# Altium project 传感器模块.PrjPcb
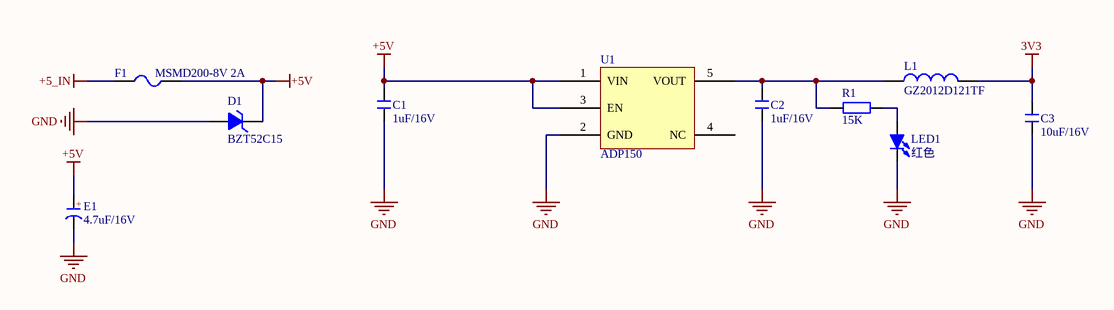
[diagram p0: POW.SchDoc]
6 sheets, 87 parts. Net scope: global (net labels, ports and power ports of the same name join across sheets).
Board file: PCB1.PcbDoc
Sheets:
  POW.SchDoc
  BMX160.SchDoc
  BME280.SchDoc
  TMP102.SchDoc
  OPT3001.SchDoc
  OUT_PIN.SchDoc

## Sheet POW.SchDoc
size A4; SheetNumber: 1; SheetTotal: 6

### Parts
C1  1uF/16V  [C 0402_L]
C2  1uF/16V  [C 0402_L]
C3  10uF/16V  [C 0603_L]
D1  BZT52C15  [SOD-123]
E1  4.7uF/16V  [CD A(3216)]
F1  MSMD200-8V 2A  [FU 0603]
L1  GZ2012D121TF  [L 0805]
LED1  红色  [LED]
R1  15K  [R 0402_L]
U1  ADP150  [SOT23-5]

### Nets
3V3: C3.2 L1.2
+5_IN: F1.1
+5V: C1.2 D1.2(K) E1.1(A) F1.2 U1.1(VIN) U1.3(EN)
GND: C1.1 C2.1 C3.1 D1.1(A) E1.2(K) LED1.2(K) U1.2(GND)
NetC2_2: C2.2 L1.1 R1.1 U1.5(VOUT)
NetLED1_1: LED1.1(A) R1.2

Not connected (* = marked no-connect by the designer): U1 4(NC)

### Notes on the sheet
- (in symbol C-CD) +

### Library data of the parts
C1 C2 = C: 贴片电容; 主类型: 电容; 值精度: ±10%; 元件封装: 0402; 具体类型: 陶瓷电容; 封装类型: 贴片; 温度漂移: X5R; 生产商: SAMSUNG(三星); 生产商零件编码: CL05A105KO5NNNC; 值/型号: 1uF/16V; 立创编号: C29266
C3 = C: 贴片电容; 主类型: 电容; 值精度: ±10%; 元件封装: 0603; 具体类型: 陶瓷电容; 封装类型: 贴片; 温度漂移: X5R; 生产商: SAMSUNG(三星); 生产商零件编码: CL10A106MO8NQNC; 值/型号: 10uF/16V; 立创编号: C92487
D1 = IN4735A: 主类型: 二极管; 具体类型: 稳压二极管; 封装类型: 贴片; 生产商: MDD; 值/型号: BZT52C15; 元件封装: SOD-123; 生产商零件编码: BZT52C15; 立创编号: C173427
E1 = C-CD: 聚合物电容 4.7uF/16V; 主类型: 电容; 值精度: ±20%; 元件封装: CASE-A_3216; 封装类型: 贴片; 温度范围: -55℃ ~ +105℃; 生产商: Sunlord(顺络); 生产商零件编码: TC211A475M016A; 值/型号: 4.7uF/16V; 具体类型: 聚合物电容; 立创编号: C136628
F1 = FU: 贴片保险丝; 版权归属: 源创客; BOM名称: 贴片保险丝; 学习资源: www.ooocke.com
L1 = L: 小功率贴片电感; 主类型: 电感; 生产商: Sunlord(顺络); 值/型号: GZ2012D121TF; 生产商零件编码: GZ2012D121TF; 立创编号: C38480
LED1 = LED-SMD: C84267
R1 = R: 贴片电阻 0402 5%; 主类型: 电阻; 值精度: ±1%; 元件封装: 0402; 封装类型: 贴片; 温度漂移: 50ppm; 生产商: 国巨; 生产商零件编码: RT0402FRE0715KL; 值/型号: 15K; 具体类型: 贴片电阻; 立创编号: C136975
U1 = ADP150: ADP150AUJZ-3.3-R7; 主类型: 电源芯片; 元件封装: SOT-23-5; 具体类型: 线性稳压芯片; 封装类型: 贴片; 生产商: ADI(亚德诺)/LINEAR; 值/型号: ADP150AUJZ-3.3-R7; 生产商零件编码: ADP150AUJZ-3.3-R7; 立创编号: C29149

## Sheet BMX160.SchDoc
size A4; SheetNumber: 2; SheetTotal: 6
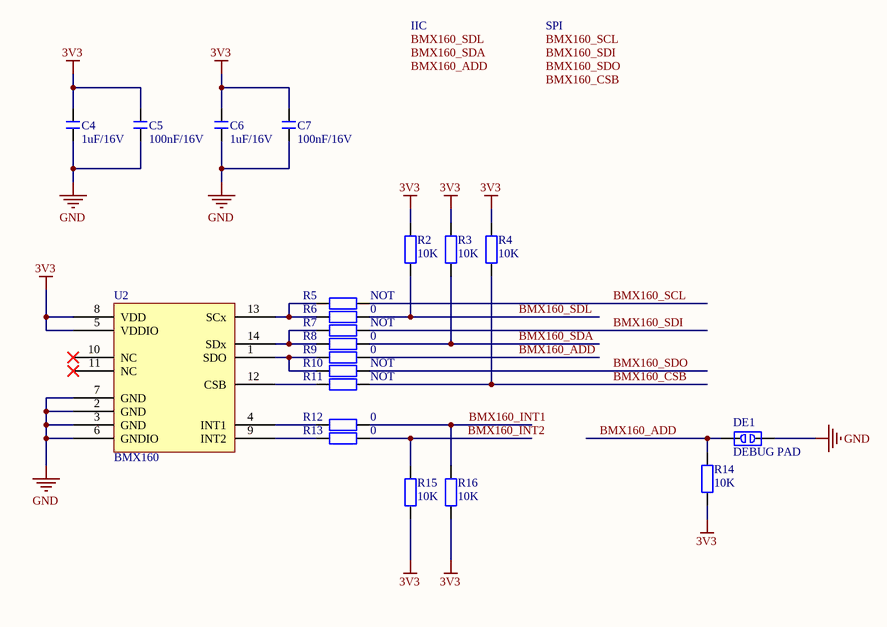
[diagram p1: BMX160.SchDoc]

### Parts
C4  1uF/16V  [C 0402_L]
C5  100nF/16V  [C 0402_L]
C6  1uF/16V  [C 0402_L]
C7  100nF/16V  [C 0402_L]
DE1  DEBUG PAD  [DEBUG_A]
R2  10K  [R 0402_L]
R3  10K  [R 0402_L]
R4  10K  [R 0402_L]
R5  NOT  [R 0402_L]
R6  0  [R 0402_L]
R7  NOT  [R 0402_L]
R8  0  [R 0402_L]
R9  0  [R 0402_L]
R10  NOT  [R 0402_L]
R11  NOT  [R 0402_L]
R12  0  [R 0402_L]
R13  0  [R 0402_L]
R14  10K  [R 0402_L]
R15  10K  [R 0402_L]
R16  10K  [R 0402_L]
U2  BMX160  [BMX160]

### Nets
3V3: C4.2 C5.1 C6.2 C7.1 R2.1 R3.1 R4.1 R14.1 R15.1 R16.1 U2.5(VDDIO) U2.8(VDD)
GND: C4.1 C5.2 C6.1 C7.2 DE1.2 U2.2(GND) U2.3(GND) U2.6(GNDIO) U2.7(GND)
BMX160_ADD: DE1.1 R9.1 R14.2
BMX160_CSB: R4.2 R11.1
BMX160_INT1: R12.1 R16.2
BMX160_INT2: R13.1 R15.2
BMX160_SCL: R5.1
BMX160_SDA: R3.2 R8.1
BMX160_SDI: R7.1
BMX160_SDL: R2.2 R6.1
BMX160_SDO: R10.1
NetR5_2: R5.2 R6.2 U2.13(SCx)
NetR7_2: R7.2 R8.2 U2.14(SDx)
NetR9_2: R9.2 R10.2 U2.1(SDO)
NetR11_2: R11.2 U2.12(CSB)
NetR12_2: R12.2 U2.4(INT1)
NetR13_2: R13.2 U2.9(INT2)

Not connected (* = marked no-connect by the designer): U2 10(NC)* 11(NC)*

### Notes on the sheet
- IIC
- SPI
- Labels drawn without touching a wire or pin: BMX160_ADD, BMX160_CSB, BMX160_SCL, BMX160_SDA, BMX160_SDI, BMX160_SDL, BMX160_SDO

### Library data of the parts
C4 C6 = C: as C1 on sheet POW; 值/型号: 1uF/16V; 立创编号: C29266
C5 C7 = C: 无极性贴片电容; 主类型: 电容; 封装类型: 贴片; 生产商: YAGEO(国巨); 生产商零件编码: CC0402KRX7R7BB104; 值/型号: 100nF/16V; 元件封装: *; 具体类型: *; 温度漂移: *; 温度范围: *; 立创编号: C60474; 类型备注: *; 手册网址: *; 官网地址: *
DE1 = DEBUG: 调试断点焊盘; 版权归属: 源创客; BOM名称: 调试断点焊盘; 学习资源: www.ooocke.com
R2-R4 R14-R16 = R: 贴片电阻 0402 1%; 主类型: 电阻; 元件封装: 0402; 封装类型: 贴片; 温度漂移: ±100ppm/℃; 生产商: 国巨; 生产商零件编码: RC0402FR-0710KL; 值/型号: 10K; 值精度: ±1%; 具体类型: 贴片电阻; 立创编号: C60490
R5 R7 R10 R11 = R: 贴片电阻; 主类型: 电阻; 值/型号: 0; 元件封装: 0402; 封装类型: 贴片; 生产商: YAGEO（国巨）; 生产商零件编码: RC0402FR-0710KL; 立创编号: C60490
R6 R8 R9 R12 R13 = R: 贴片电阻; 主类型: 电阻; 元件封装: 0402; 封装类型: 贴片; 生产商: YAGEO（国巨）; 生产商零件编码: RC0402FR-0710KL; 值/型号: 0; 立创编号: C60490

## Sheet BME280.SchDoc
size A4; SheetNumber: 3; SheetTotal: 6
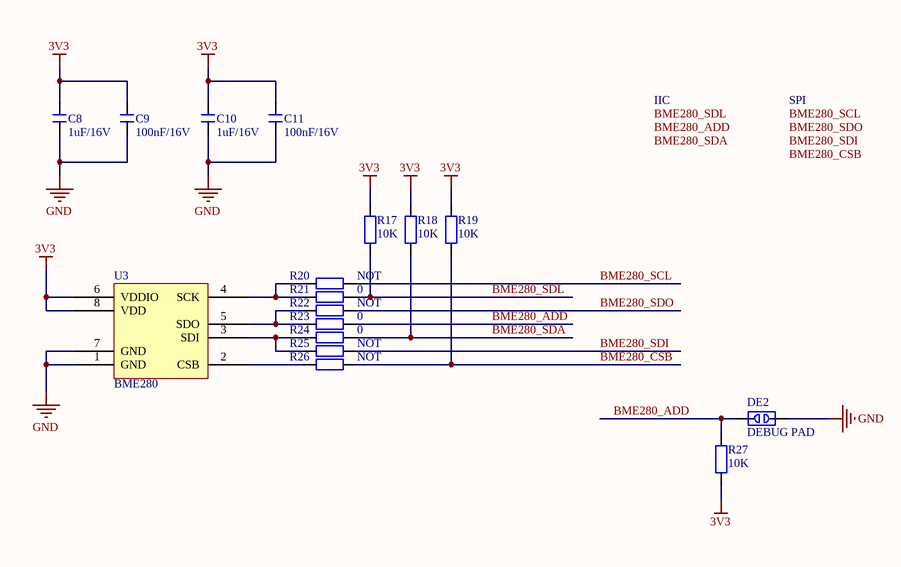
[diagram p2: BME280.SchDoc]

### Parts
C8  1uF/16V  [C 0402_L]
C9  100nF/16V  [C 0402_L]
C10  1uF/16V  [C 0402_L]
C11  100nF/16V  [C 0402_L]
DE2  DEBUG PAD  [DEBUG_A]
R17  10K  [R 0402_L]
R18  10K  [R 0402_L]
R19  10K  [R 0402_L]
R20  NOT  [R 0402_L]
R21  0  [R 0402_L]
R22  NOT  [R 0402_L]
R23  0  [R 0402_L]
R24  0  [R 0402_L]
R25  NOT  [R 0402_L]
R26  NOT  [R 0402_L]
R27  10K  [R 0402_L]
U3  BME280  [BME280]

### Nets
3V3: C8.2 C9.1 C10.2 C11.1 R17.1 R18.1 R19.1 R27.1 U3.6(VDDIO) U3.8(VDD)
GND: C8.1 C9.2 C10.1 C11.2 DE2.2 U3.1(GND) U3.7(GND)
BME280_ADD: DE2.1 R23.1 R27.2
BME280_CSB: R19.2 R26.1
BME280_SCL: R20.1
BME280_SDA: R18.2 R24.1
BME280_SDI: R25.1
BME280_SDL: R17.2 R21.1
BME280_SDO: R22.1
NetR20_2: R20.2 R21.2 U3.4(SCK)
NetR22_2: R22.2 R23.2 U3.5(SDO)
NetR24_2: R24.2 R25.2 U3.3(SDI)
NetR26_2: R26.2 U3.2(CSB)

### Notes on the sheet
- IIC
- SPI
- Labels drawn without touching a wire or pin: BME280_ADD, BME280_CSB, BME280_SCL, BME280_SDA, BME280_SDI, BME280_SDL, BME280_SDO

### Library data of the parts
C8 C10 = C: as C1 on sheet POW; 值/型号: 1uF/16V; 立创编号: C29266
C9 C11 = C: as C5 on sheet BMX160; 值/型号: 100nF/16V; 元件封装: *; 具体类型: *; 温度漂移: *; 温度范围: *; 立创编号: C60474; 类型备注: *; 手册网址: *; 官网地址: *
DE2 = DEBUG: 调试断点焊盘; 版权归属: 源创客; BOM名称: 调试断点焊盘; 学习资源: www.ooocke.com
R17-R19 R27 = R: as R2 on sheet BMX160; 值/型号: 10K; 值精度: ±1%; 具体类型: 贴片电阻; 立创编号: C60490
R20 R22 R25 R26 = R: 贴片电阻; 主类型: 电阻; 值/型号: 0; 元件封装: 0402; 生产商: YAGEO(国巨); 生产商零件编码: RC0402JR-070RL; 立创编号: C60485
R21 R23 R24 = R: 贴片电阻; 主类型: 电阻; 元件封装: 0402; 生产商: YAGEO(国巨); 生产商零件编码: RC0402JR-070RL; 值/型号: 0; 立创编号: C60485

## Sheet TMP102.SchDoc
size A4; SheetNumber: 4; SheetTotal: 6
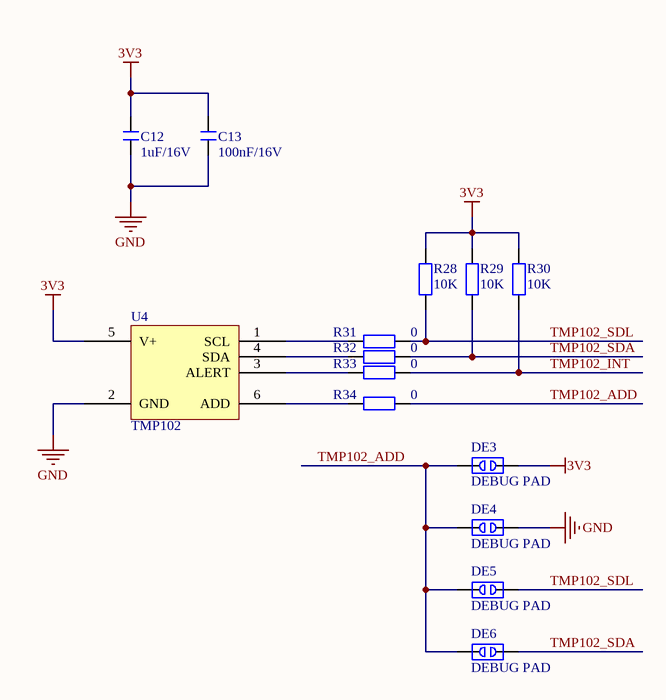
[diagram p3: TMP102.SchDoc]

### Parts
C12  1uF/16V  [C 0402_L]
C13  100nF/16V  [C 0402_L]
DE3  DEBUG PAD  [DEBUG_A]
DE4  DEBUG PAD  [DEBUG_A]
DE5  DEBUG PAD  [DEBUG_A]
DE6  DEBUG PAD  [DEBUG_A]
R28  10K  [R 0402_L]
R29  10K  [R 0402_L]
R30  10K  [R 0402_L]
R31  0  [R 0402_L]
R32  0  [R 0402_L]
R33  0  [R 0402_L]
R34  0  [R 0402_L]
U4  TMP102  [TMP102]

### Nets
3V3: C12.2 C13.1 DE3.2 R28.1 R29.1 R30.1 U4.5(V+)
GND: C12.1 C13.2 DE4.2 U4.2(GND)
TMP102_ADD: DE3.1 DE4.1 DE5.1 DE6.1 R34.1
TMP102_INT: R30.2 R33.1
TMP102_SDA: DE6.2 R29.2 R32.1
TMP102_SDL: DE5.2 R28.2 R31.1
NetR31_2: R31.2 U4.1(SCL)
NetR32_2: R32.2 U4.4(SDA)
NetR33_2: R33.2 U4.3(ALERT)
NetR34_2: R34.2 U4.6(ADD)

### Library data of the parts
C12 = C: as C1 on sheet POW; 值/型号: 1uF/16V; 立创编号: C29266
C13 = C: as C5 on sheet BMX160; 值/型号: 100nF/16V; 元件封装: *; 具体类型: *; 温度漂移: *; 温度范围: *; 立创编号: C60474; 类型备注: *; 手册网址: *; 官网地址: *
DE3-DE6 = DEBUG: 调试断点焊盘; 版权归属: 源创客; BOM名称: 调试断点焊盘; 学习资源: www.ooocke.com
R28-R30 = R: as R2 on sheet BMX160; 值/型号: 10K; 值精度: ±1%; 具体类型: 贴片电阻; 立创编号: C60490
R31-R34 = R: as R21 on sheet BME280; 值/型号: 0; 立创编号: C60485

## Sheet OPT3001.SchDoc
size A4; SheetNumber: 5; SheetTotal: 6
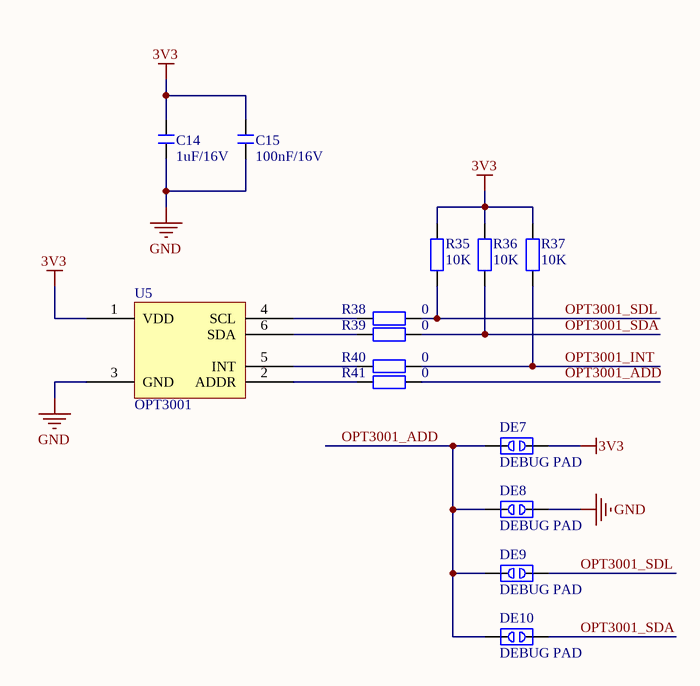
[diagram p4: OPT3001.SchDoc]

### Parts
C14  1uF/16V  [C 0402_L]
C15  100nF/16V  [C 0402_L]
DE7  DEBUG PAD  [DEBUG_A]
DE8  DEBUG PAD  [DEBUG_A]
DE9  DEBUG PAD  [DEBUG_A]
DE10  DEBUG PAD  [DEBUG_A]
R35  10K  [R 0402_L]
R36  10K  [R 0402_L]
R37  10K  [R 0402_L]
R38  0  [R 0402_L]
R39  0  [R 0402_L]
R40  0  [R 0402_L]
R41  0  [R 0402_L]
U5  OPT3001  [OPT3001]

### Nets
3V3: C14.2 C15.1 DE7.2 R35.1 R36.1 R37.1 U5.1(VDD)
GND: C14.1 C15.2 DE8.2 U5.3(GND)
OPT3001_ADD: DE7.1 DE8.1 DE9.1 DE10.1 R41.1
OPT3001_INT: R37.2 R40.1
OPT3001_SDA: DE10.2 R36.2 R39.1
OPT3001_SDL: DE9.2 R35.2 R38.1
NetR38_2: R38.2 U5.4(SCL)
NetR39_2: R39.2 U5.6(SDA)
NetR40_2: R40.2 U5.5(INT)
NetR41_2: R41.2 U5.2(ADDR)

### Library data of the parts
C14 = C: as C1 on sheet POW; 值/型号: 1uF/16V; 立创编号: C29266
C15 = C: as C5 on sheet BMX160; 值/型号: 100nF/16V; 元件封装: *; 具体类型: *; 温度漂移: *; 温度范围: *; 立创编号: C60474; 类型备注: *; 手册网址: *; 官网地址: *
DE7-DE10 = DEBUG: 调试断点焊盘; 版权归属: 源创客; BOM名称: 调试断点焊盘; 学习资源: www.ooocke.com
R35-R37 = R: as R2 on sheet BMX160; 值/型号: 10K; 值精度: ±1%; 具体类型: 贴片电阻; 立创编号: C60490
R38-R41 = R: as R21 on sheet BME280; 值/型号: 0; 立创编号: C60485

## Sheet OUT_PIN.SchDoc
size A4; SheetNumber: 6; SheetTotal: 6
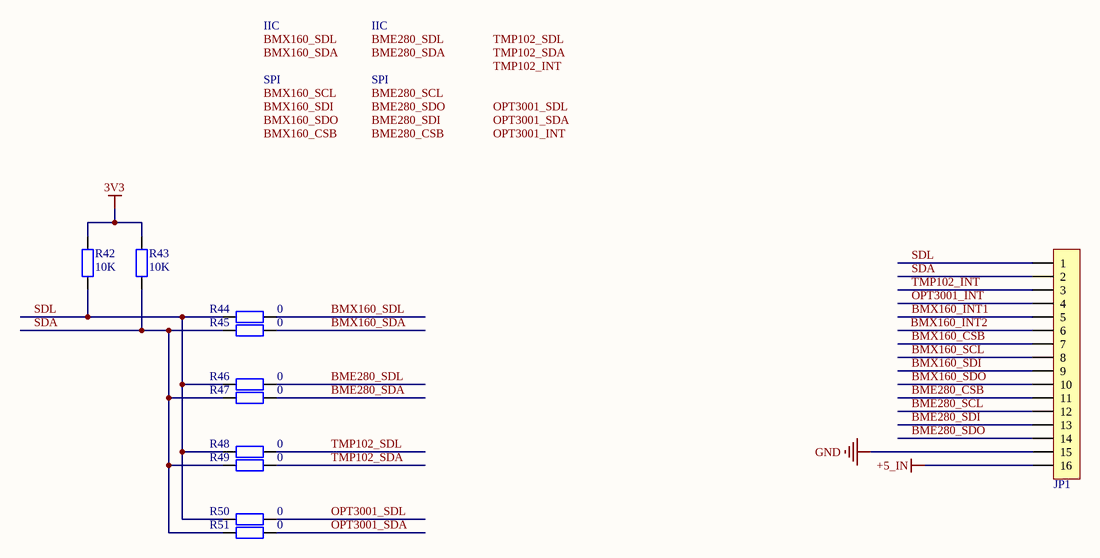
[diagram p5: OUT_PIN.SchDoc]

### Parts
JP1  HDR-1X16  [HDR2.54-LI-16P]  (value not drawn)
R42  10K  [R 0402_L]
R43  10K  [R 0402_L]
R44  0  [R 0402_L]
R45  0  [R 0402_L]
R46  0  [R 0402_L]
R47  0  [R 0402_L]
R48  0  [R 0402_L]
R49  0  [R 0402_L]
R50  0  [R 0402_L]
R51  0  [R 0402_L]

### Nets
3V3: R42.1 R43.1
+5_IN: JP1.16
GND: JP1.15
BME280_CSB: JP1.11
BME280_SCL: JP1.12
BME280_SDA: R47.1
BME280_SDI: JP1.13
BME280_SDL: R46.1
BME280_SDO: JP1.14
BMX160_CSB: JP1.7
BMX160_INT1: JP1.5
BMX160_INT2: JP1.6
BMX160_SCL: JP1.8
BMX160_SDA: R45.1
BMX160_SDI: JP1.9
BMX160_SDL: R44.1
BMX160_SDO: JP1.10
OPT3001_INT: JP1.4
OPT3001_SDA: R51.1
OPT3001_SDL: R50.1
SDA: JP1.2 R43.2 R45.2 R47.2 R49.2 R51.2
SDL: JP1.1 R42.2 R44.2 R46.2 R48.2 R50.2
TMP102_INT: JP1.3
TMP102_SDA: R49.1
TMP102_SDL: R48.1

### Notes on the sheet
- IIC
- SPI
- Labels drawn without touching a wire or pin: BME280_CSB, BME280_SCL, BME280_SDA, BME280_SDI, BME280_SDL, BME280_SDO, BMX160_CSB, BMX160_SCL, BMX160_SDA, BMX160_SDI, BMX160_SDL, BMX160_SDO, OPT3001_INT, OPT3001_SDA, OPT3001_SDL, TMP102_INT, TMP102_SDA, TMP102_SDL

### Library data of the parts
JP1 = Header 16: 16P接插件; 版权归属: 源创客; BOM名称: 16P接插件; 学习资源: www.ooocke.com
R42 R43 = R: as R2 on sheet BMX160; 值/型号: 10K; 值精度: ±1%; 具体类型: 贴片电阻; 立创编号: C60490
R44-R51 = R: 贴片电阻; 主类型: 电阻; 生产商: YAGEO（国巨）; 生产商零件编码: RC0402JR-070RL; 值/型号: 0; 立创编号: C60485

## Nets that join several sheets
3V3: POW (C3.2 L1.2), BMX160 (12 pins), BME280 (10 pins), TMP102 (7 pins), OPT3001 (7 pins), OUT_PIN (R42.1 R43.1)
+5_IN: POW (F1.1), OUT_PIN (JP1.16)
GND: POW (7 pins), BMX160 (9 pins), BME280 (7 pins), TMP102 (C12.1 C13.2 DE4.2 U4.2), OPT3001 (C14.1 C15.2 DE8.2 U5.3), OUT_PIN (JP1.15)
BME280_CSB: BME280 (R19.2 R26.1), OUT_PIN (JP1.11)
BME280_SCL: BME280 (R20.1), OUT_PIN (JP1.12)
BME280_SDA: BME280 (R18.2 R24.1), OUT_PIN (R47.1)
BME280_SDI: BME280 (R25.1), OUT_PIN (JP1.13)
BME280_SDL: BME280 (R17.2 R21.1), OUT_PIN (R46.1)
BME280_SDO: BME280 (R22.1), OUT_PIN (JP1.14)
BMX160_CSB: BMX160 (R4.2 R11.1), OUT_PIN (JP1.7)
BMX160_INT1: BMX160 (R12.1 R16.2), OUT_PIN (JP1.5)
BMX160_INT2: BMX160 (R13.1 R15.2), OUT_PIN (JP1.6)
BMX160_SCL: BMX160 (R5.1), OUT_PIN (JP1.8)
BMX160_SDA: BMX160 (R3.2 R8.1), OUT_PIN (R45.1)
BMX160_SDI: BMX160 (R7.1), OUT_PIN (JP1.9)
BMX160_SDL: BMX160 (R2.2 R6.1), OUT_PIN (R44.1)
BMX160_SDO: BMX160 (R10.1), OUT_PIN (JP1.10)
OPT3001_INT: OPT3001 (R37.2 R40.1), OUT_PIN (JP1.4)
OPT3001_SDA: OPT3001 (DE10.2 R36.2 R39.1), OUT_PIN (R51.1)
OPT3001_SDL: OPT3001 (DE9.2 R35.2 R38.1), OUT_PIN (R50.1)
TMP102_INT: TMP102 (R30.2 R33.1), OUT_PIN (JP1.3)
TMP102_SDA: TMP102 (DE6.2 R29.2 R32.1), OUT_PIN (R49.1)
TMP102_SDL: TMP102 (DE5.2 R28.2 R31.1), OUT_PIN (R48.1)